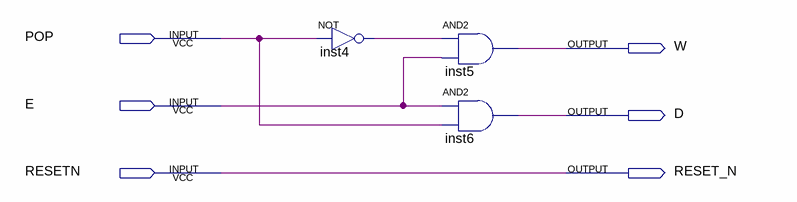
[diagram p0: schematic sheet]
// Quartus schematic CONTROL_LOGIC.bdf as structural Verilog: 3 symbols, 6 pins
module CONTROL_LOGIC (
  input  POP,
  input  E,
  input  RESETN,
  output W,
  output D,
  output RESET_N
);

  wire inst4_out;

  not inst4 (inst4_out, POP);
  and inst5 (W, inst4_out, E);
  and inst6 (D, E, POP);

  assign RESET_N = RESETN;
endmodule
